# EAGLE design siren (EAGLE 6.0)
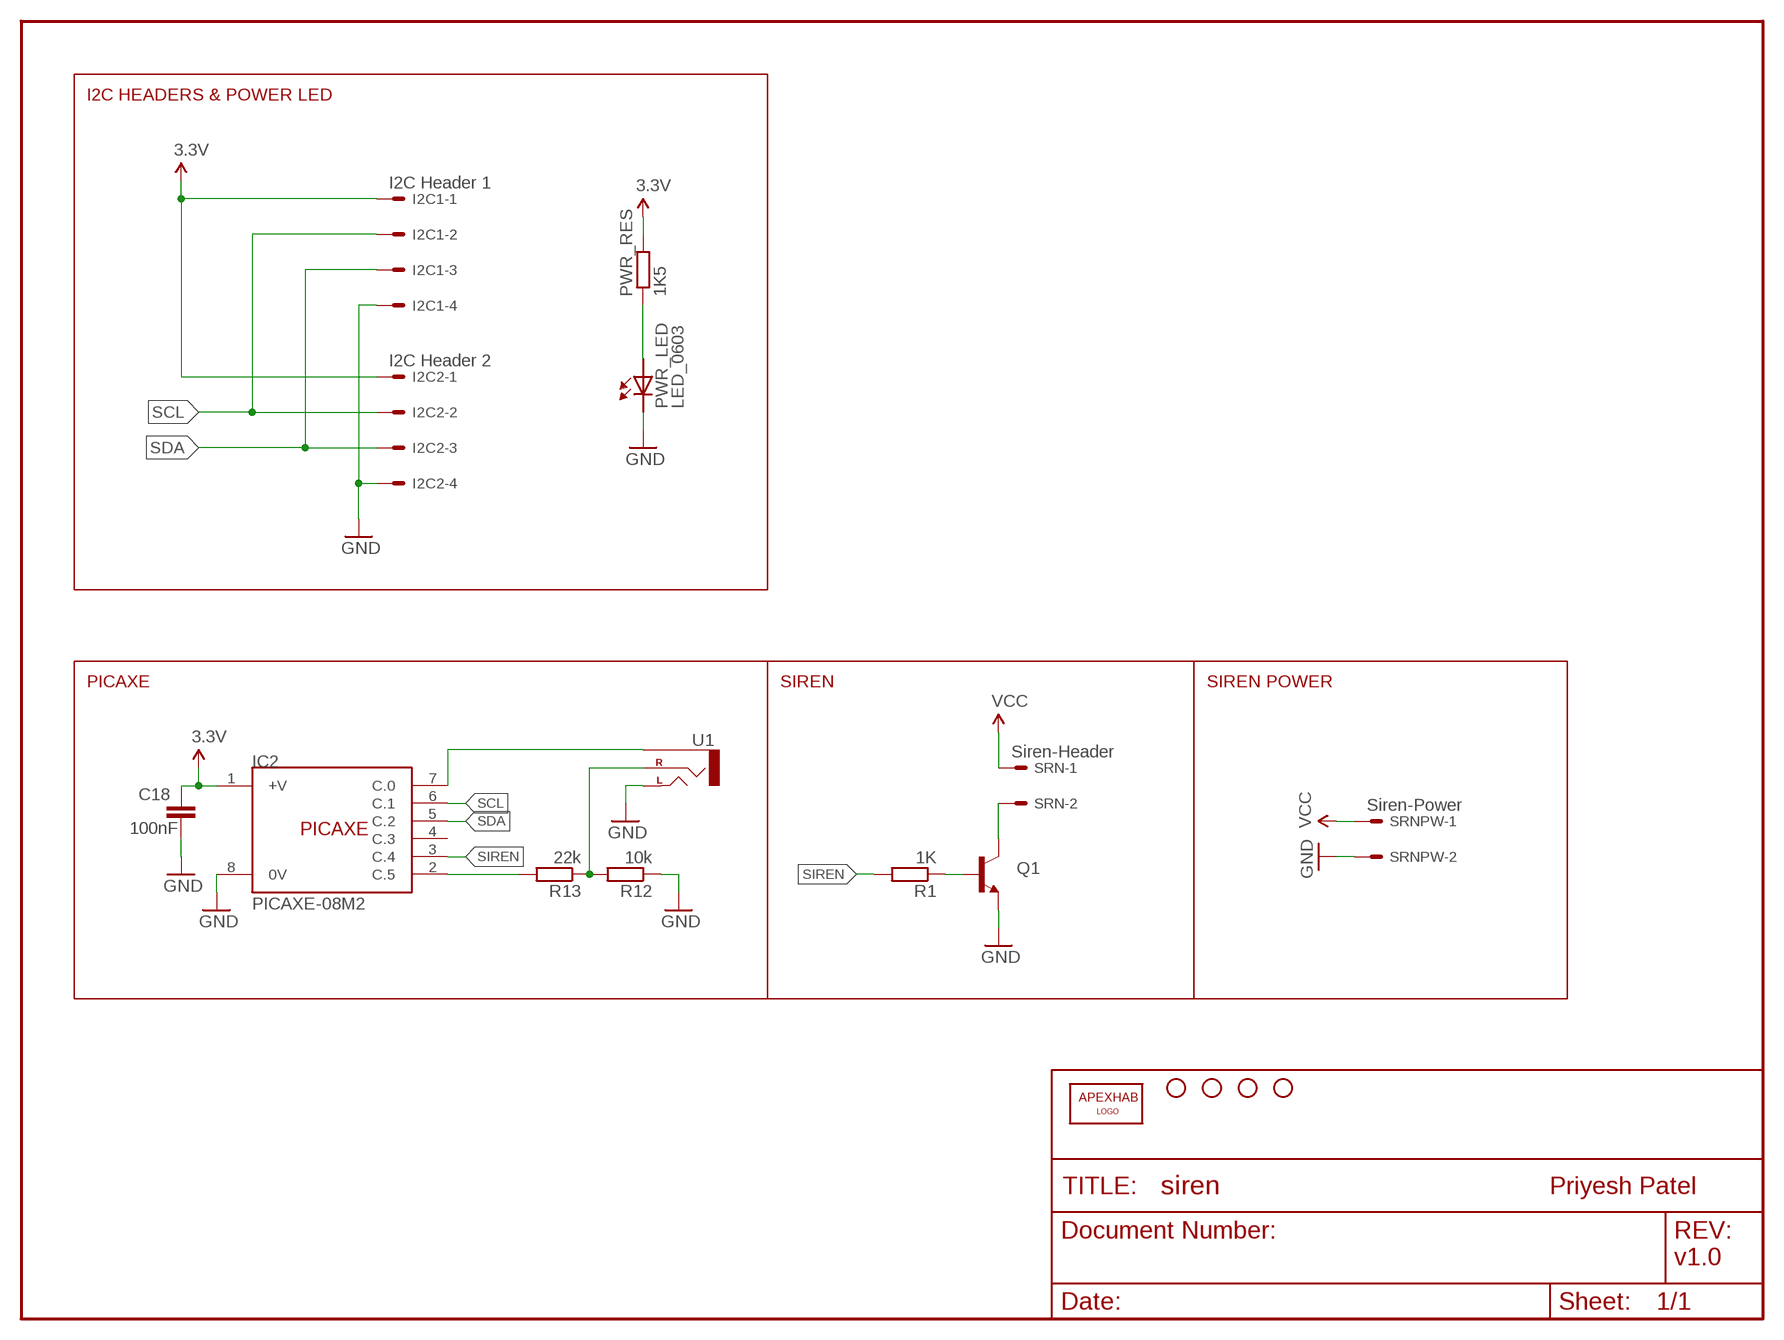
[diagram p0: schematic, sheet 1]

## Parts
C18  100nF  C-EUC0805  [C0805]
I2C1  I2C Header 1  22-27-2041-04  [6410-04]
I2C2  I2C Header 2  22-27-2041-04  [6410-04]
IC2  PICAXE-08M2  [SOIC8]
JP1  APEXHAB-LOGO_APEXHAB-SMALL  [APEXHAB-LOGO-SMALL]
JP2  STAND-OFF  [STAND-OFF]
JP3  STAND-OFF  [STAND-OFF]
JP4  STAND-OFF  [STAND-OFF]
JP5  STAND-OFF  [STAND-OFF]
PWR_LED  LED_0603  [CHIPLED_0603]
PWR_RES  1K5  R-EU_R0805  [R0805]
Q1  TRANSISTOR_NPN"  [SOT223]
R1  1K  R-EU_R0805  [R0805]
R12  10k  R-EU_R0805  [R0805]
R13  22k  R-EU_R0805  [R0805]
SRN  Siren-Header  22-27-2021-02  [6410-02]
SRNPW  Siren-Power  22-27-2021-02  [6410-02]
U1  AUDIO-JACKPTH  [AUDIO-JACK]

## Nets
3.3V: C18.1 I2C1.1 I2C2.1 IC2.1(+V) PWR_RES.2
GND: C18.2 I2C1.4 I2C2.4 IC2.8(0V) PWR_LED.C Q1.3(E) R12.1 SRNPW.2 U1.TIP(LEFT)
N$1: Q1.1(B) R1.1
N$2: Q1.2(C) SRN.2
N$17: IC2.2(C.5) R13.2
N$18: IC2.7(C.0) U1.SLEEVE
N$20: R12.2 R13.1 U1.RING(RIGHT)
N$21: PWR_LED.A PWR_RES.1
SCL: I2C1.2 I2C2.2 IC2.6(C.1)
SDA: I2C1.3 I2C2.3 IC2.5(C.2)
SIREN: IC2.3(C.4) R1.2
VCC: SRN.1 SRNPW.1
Unconnected: IC2.4(C.3)

## Notes on the sheet
- I2C HEADERS & POWER LED
- PICAXE | SIREN | SIREN POWER
- Priyesh Patel
- v1.0

## Library data of the parts
C18 = rcl:C-EU: CAPACITOR, European symbol
I2C1 I2C2 = apex:22-?-04: CONNECTOR wire to board 2.54 mm (.1 inch) pitch header; OC_FARNELL: unknown; OC_NEWARK: unknown
IC2 = apex:PICAXE-08M2
JP1 = apex:APEXHAB-LOGO: ApexHAB PCB Logo This is the standard ApexHAB PCB logo.
JP2-JP5 = apex:STAND-OFF: Stand Off This is the mechanical footprint for a #4 phillips button head screw. Use the keepout ring to avoid running the screw head into surrounding components. SKU : PRT-00447
PWR_LED = apex:LED: SMD LED
PWR_RES R1 R12 R13 = rcl:R-EU_: RESISTOR, European symbol
Q1 = SparkFun:TRANSISTOR_NPN: Transistor NPN BJT configuration in SOT23 package. MMBT2222 is the common NPN we use. Double check BCE configuration again layout.
SRN SRNPW = apex:22-?-02: CONNECTOR wire to board 2.54 mm (.1 inch) pitch header; OC_FARNELL: unknown; OC_NEWARK: unknown
U1 = SparkFun:AUDIO-JACK: 3.5mm Audio Jack Simple 3.5mm common PCB mount audio jack. SKU: PRT-08032

## Board
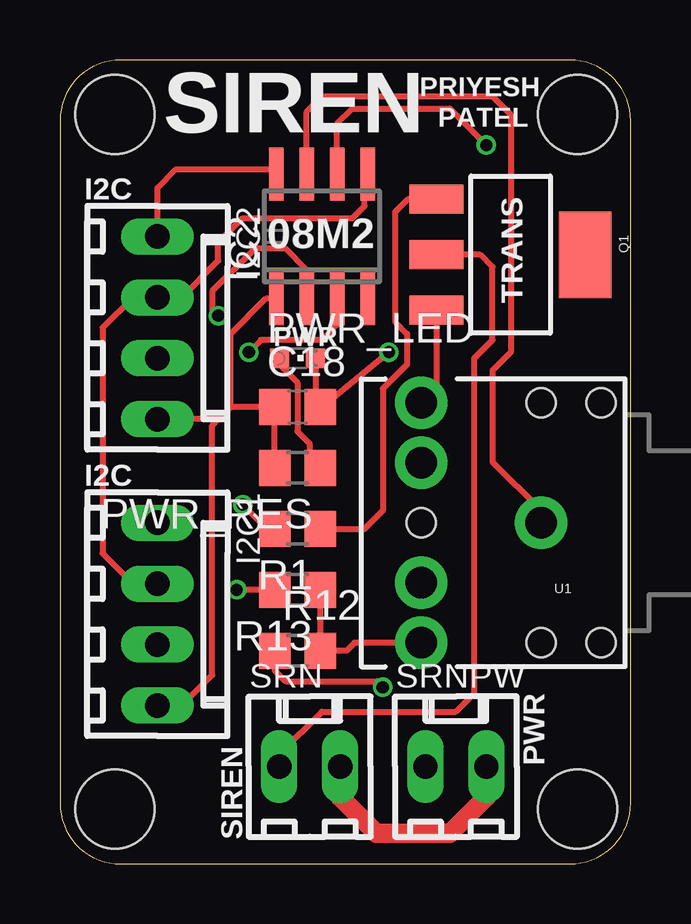
[diagram p1: board, top side]
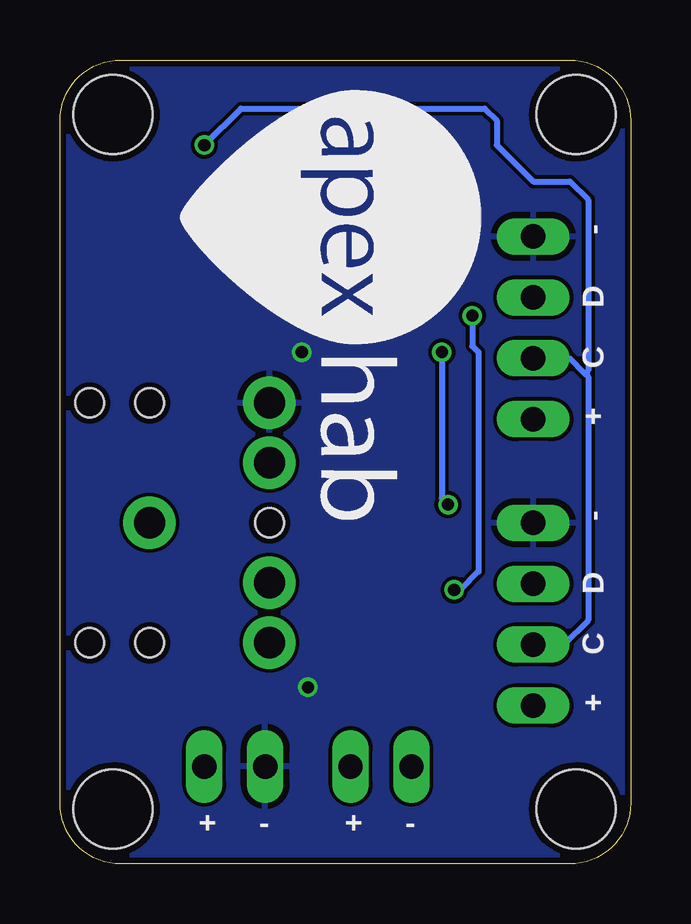
[diagram p2: board, bottom side, seen from below]

Size 23.8 x 33.52 mm. Coordinates in mm from the lower left corner, seen from the top.
Outline: 0,30.98 0,2.54 arc90 2.54,0 21.26,0 arc90 23.8,2.54 23.8,30.98 arc90 21.26,33.52 2.54,33.52 arc90 0,30.98
Copper layers (1*16): Top 0.035mm / dielectric 1.5mm / Bottom 0.035mm
Design rules: minimum track width 6mil, minimum drill 12mil, track to track 6mil, track to pad 6mil, pad to pad 6mil, via to via 6mil, smd to smd 0mil, copper to edge 10mil, drill to drill 10mil, minimum pad ring 10mil, minimum via ring 6mil, stop-mask expansion 2mil, vias tented up to drill 100mil, thermal gap 10mil

### Footprints (pad centres in the part's own frame; a part is rotated, then mirrored left to right if it is on the bottom)
C0805 = smd 1.3 x 1.5: 1 -0.95,0; 2 0.95,0
6410-04 = drill 1.016 long: 1 3.81,0; 2 1.27,0; 3 -1.27,0; 4 -3.81,0
SOIC8 = smd 0.6 x 2.2: 1 -1.905,-2.6; 2 -0.635,-2.6; 3 0.635,-2.6; 4 1.905,-2.6; 5 1.905,2.6; 6 0.635,2.6; 7 -0.635,2.6; 8 -1.905,2.6
STAND-OFF = hole 3.302: 0,0
CHIPLED_0603 = smd 0.8 x 0.8: A 0,-0.75; C 0,0.75
R0805 = smd 1.3 x 1.5: 1 -0.95,0; 2 0.95,0
SOT223 = smd 1.219 x 2.235: 1 -2.311,-3.099; 2 0,-3.099; 3 2.311,-3.099 | smd 3.6 x 2.2: 4 0,3.099
6410-02 = drill 1.016 long: 1 1.27,0; 2 -1.27,0
AUDIO-JACK = drill 1.3 pad 2.184: RING 5,5; RSH 5,2.5; SLEEVE 0,0; TIP 5,-5; TSH 5,-2.5 | hole 1.2: 0,5; -2.5,5; -2.5,-5; 0,-5; 5,0

### Placement (x,y rotation side)
C18  9.91,19.05 0 top
I2C1  4.06,10.41 270 top
I2C2  4.06,22.35 270 top
IC2  10.92,26.16 0 top
JP1  18.8,32.26 270 bottom
JP2  2.29,31.24 0 top
JP3  21.59,31.24 0 top
JP4  2.29,2.29 0 top
JP5  21.59,2.29 0 top
PWR_LED  9.91,21.08 270 top
PWR_RES  9.91,16.51 180 top
Q1  18.8,25.4 270 top
R1  9.91,13.97 180 top
R12  9.91,8.89 0 top
R13  9.91,11.43 180 top
SRN  10.41,4.06 0 top
SRNPW  16.51,4.06 0 top
U1  20.07,14.22 180 top

### Tracks (layer width: path | path; a pad name or v marks a point on that pad's centre or on a via)
3.3V
  Top 0.254: PWR_RES.2 C18.1 7.11,19.05 | 7.11,19.05 6.6,18.54 | 6.6,18.54 I2C2.1 | I2C1.1 5.08,6.6 6.35,7.87 6.35,18.29 6.6,18.54 | IC2.1 8.58,23.56 7.11,22.1 7.11,19.05
GND  (via drill 0.51)
  Top 0.254: I2C2.4 4.06,28.19 4.83,28.96 8.82,28.96 IC2.8 | Q1.3 15.7,19.86 U1.TIP | PWR_LED.C 10.66,19.25 C18.2 10.92,19.05 v13.72,21.34 | R12.1 8.96,8.06 9.4,7.62 13.21,7.62 v13.46,7.37
  pour Bottom: 0,33.53 23.88,33.53 23.88,0 0,0
N$1
  Top 0.254: Q1.1 14.5,27.71 13.97,27.18 13.97,22.61 14.48,22.1 14.48,20.83 13.46,19.81 13.46,14.73 12.7,13.97 R1.1
N$2
  Top 0.254: SRN.2 9.14,4.57 10.92,6.35 16.51,6.35 17.27,7.11 17.27,21.08 18.03,21.84 18.03,24.89 17.53,25.4 Q1.2
N$17  (via drill 0.51)
  Top 0.254: IC2.2 10.29,24.77 9.4,25.65 8.13,25.65 6.35,23.88 6.35,23.11 v6.6,22.86 | R13.2 v7.37,11.43
  Bottom 0.254: v6.6,22.86 6.6,21.59 6.35,21.34 6.35,12.19 7.11,11.43 v7.37,11.43
N$18
  Top 0.254: IC2.7 10.29,31.37 10.92,32 18.03,32 18.8,31.24 18.8,21.34 18.03,20.57 18.03,16.76 20.07,14.73 U1.SLEEVE
N$20
  Top 0.254: U1.RING 12.27,9.22 11.94,8.89 R12.2 R13.1
N$21
  Top 0.254: PWR_LED.A 9.16,20.82 9.91,20.07 9.91,18.03 10.41,17.53 10.41,16.95 PWR_RES.1
SCL  (via drill 0.51)
  Top 0.254: IC2.6 11.56,30.86 12.19,31.5 16.26,31.5 v17.78,29.97
  Bottom 0.254: I2C2.2 2.54,21.08 1.91,20.45 | 1.91,20.45 1.78,20.32 1.78,10.16 2.79,9.14 I2C1.2 | v17.78,29.97 16.26,31.5 6.1,31.5 5.59,30.99 5.59,29.97 4.06,28.45 2.54,28.45 1.78,27.69 1.78,20.57 1.91,20.45
SDA
  Top 0.254: I2C1.3 3.05,11.68 1.78,12.95 1.78,22.35 3.05,23.62 I2C2.3 5.08,23.62 6.6,25.15 6.6,25.91 7.62,26.92 12.19,26.92 12.7,27.43 12.7,28.64 IC2.5
SIREN  (via drill 0.51)
  Top 0.254: IC2.3 11.56,22.48 10.92,21.84 8.38,21.84 v7.87,21.34 | R1.2 8.64,13.97 v7.62,14.99
  Bottom 0.254: v7.87,21.34 7.87,15.24 v7.62,14.99
VCC
  Top 0.813: SRNPW.1 17.78,2.79 16.26,1.27 13.21,1.27 11.68,2.79 SRN.1

### Text on the board
tPlace: PRIYESH | PATEL | SIREN | I2C | 08M2 | TRANS | PWR | I2C | PWR | SIREN
bPlace: - | D | C | + | - | D | C | + | - | + | - | +